# Altium project NUCLEOG431RB-Custom-IN-A2212.PrjPcb (part 2 of 4)

## Sheet Isolated_Bias.SchDoc
size B
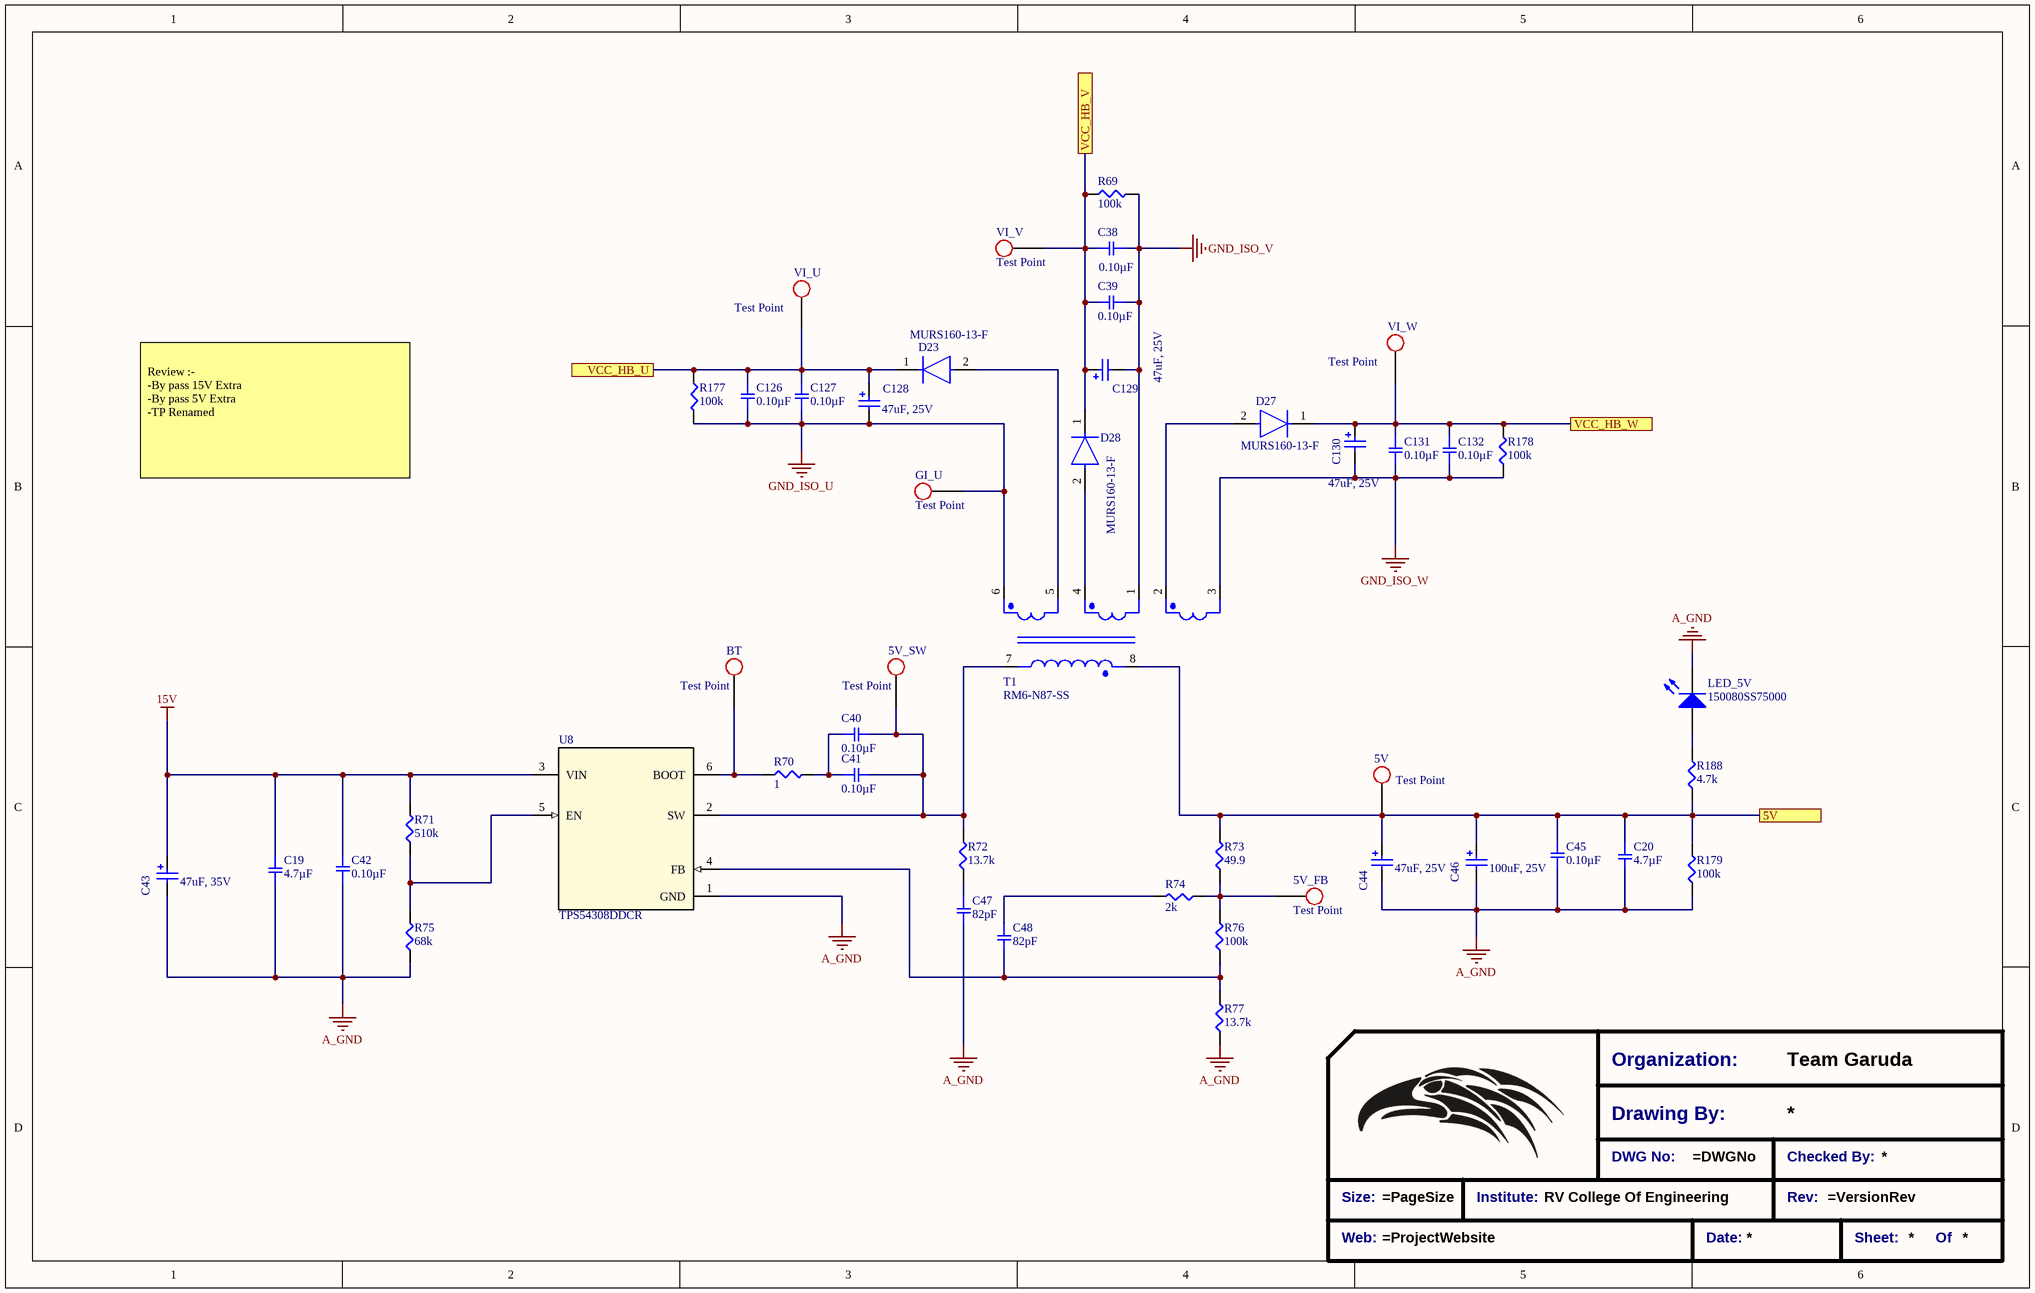
[diagram p2: Isolated_Bias.SchDoc]

### Parts
(Parts that share a designator on the sheet are numbered #1, #2 ... from top to bottom, then left to right.)
5V  Test Point  [Test_point_THT]  (no BOM)
5V_FB  Test Point  [Test_point_THT]  (no BOM)
5V_SW  Test Point  [Test_point_THT]  (no BOM)
*?#2  Title_Block  (value not drawn)  (graphical)
BT  Test Point  [Test_point_THT]  (no BOM)
C19  4.7µF  [SMD-1206C]
C20  4.7µF  [SMD-1206C]
C38  0.10µF  [SMD-0603C]
C39  0.10µF  [SMD-0805C]
C40  0.10µF  [SMD-0805C]
C41  0.10µF  [SMD-0805C]
C42  0.10µF  [SMD-0805C]
C43  47uF, 35V  [WCAP-ASLL_6.3x5.5]
C44  47uF, 25V  [WCAP-ASLL_6.3x5.5]
C45  0.10µF  [SMD-0603C]
C46  100uF, 25V  [WCAP-ASLU_8x6.5]
C47  82pF  [SMD-0805C]
C48  82pF  [SMD-0805C]
C126  0.10µF  [SMD-0805C]
C127  0.10µF  [SMD-0603C]
C128  47uF, 25V  [WCAP-ASLL_6.3x5.5]
C129  47uF, 25V  [WCAP-ASLL_6.3x5.5]
C130  47uF, 25V  [WCAP-ASLL_6.3x5.5]
C131  0.10µF  [SMD-0805C]
C132  0.10µF  [SMD-0603C]
D23  MURS160-13-F  [FP-SMB-MFG]
D27  MURS160-13-F  [FP-SMB-MFG]
D28  MURS160-13-F  [FP-SMB-MFG]
GI_U  Test Point  [Test_point_THT]  (no BOM)
LED_5V  150080SS75000  [0805_A]
R69  100k  [SMD-1206-RES]
R70  1  [SMD-0603-RES]
R71  510k  [SMD-0603-RES]
R72  13.7k  [SMD-0603-RES]
R73  49.9  [SMD-0603-RES]
R74  2k  [SMD-0603-RES]
R75  68k  [SMD-0603-RES]
R76  100k  [SMD-0603-RES]
R77  13.7k  [SMD-0603-RES]
R177  100k  [SMD-1206-RES]
R178  100k  [SMD-1206-RES]
R179  100k  [SMD-1206-RES]
R188  4.7k  [SMD-0805-RES]
T1  RM6-N87-SS  [RM6-N87-SS]
U8  TPS54308DDCR  [SOT95P278X110-6N]
VI_U  Test Point  [Test_point_THT]  (no BOM)
VI_V  Test Point  [Test_point_THT]  (no BOM)
VI_W  Test Point  [Test_point_THT]  (no BOM)

### Ports
5V, VCC_HB_U, VCC_HB_V, VCC_HB_W

### Nets
5V: 5V.1 C20.1 C44.2(P) C45.2 C46.2(P) R73.2 R179.2 R188.1 T1.8 ; port 5V
15V: C19.1 C42.2 C43.2(P) R71.2 U8.3(VIN)
A_GND: C19.2 C20.2 C42.1 C43.1(N) C44.1(N) C45.1 C46.1(N) C47.2 LED_5V.1(K) R75.1 R77.1 R179.1 U8.1(GND)
GND_ISO_U: C126.1 C127.1 C128.1(N) GI_U.1 R177.2 T1.6
GND_ISO_V: C38.1 C39.1 C129.1(N) R69.2 T1.1
GND_ISO_W: C130.1(N) C131.1 C132.1 R178.1 T1.3
VCC_HB_U: C126.2 C127.2 C128.2(P) D23.1(C) R177.1 VI_U.1 ; port VCC_HB_U
VCC_HB_V: C38.2 C39.2 C129.2(P) D28.1(C) R69.1 VI_V.1 ; port VCC_HB_V
VCC_HB_W: C130.2(P) C131.2 C132.2 D27.1(C) R178.2 VI_W.1 ; port VCC_HB_W
Net5V_FB_1: 5V_FB.1 R73.1 R74.1 R76.2
Net5V_SW_1: 5V_SW.1 C40.2 C41.2 R72.2 T1.7 U8.2(SW)
NetBT_1: BT.1 R70.1 U8.6(BOOT)
NetC40_1: C40.1 C41.1 R70.2
NetC47_1: C47.1 R72.1
NetC48_1: C48.1 R74.2
NetC48_2: C48.2 R76.1 R77.2 U8.4(FB)
NetD23_2: D23.2(A) T1.5
NetD27_2: D27.2(A) T1.2
NetD28_2: D28.2(A) T1.4
NetLED_5V_2: LED_5V.2(A) R188.2
NetR71_1: R71.1 R75.2 U8.5(EN)

### Notes on the sheet
- Review :-
  -By pass 15V Extra
  -By pass 5V Extra
  -TP Renamed
- (in symbol Title_Block) Organization:; Team Garuda; Drawing By:; DWG No:; Checked By:; Size:; Institute:; RV College Of Engineering; Rev:; Web:; Date:; Sheet:; Of

### Library data of the parts
*?#2 = Title_Block: Standard Title Block
C19 C20 = GCJ31CR71E475KA12L: CAP CER 4.7UF 25V X7R 1206; Manufacturer: Murata Electronics North America; Factory Stock: 0; Unit Price (USD): 0.65; Minimum Quantity: 1; Tolerance: ±10%; Datasheets: http://www.murata.com/~/media/webrenewal/support/library/catalog/products/capacitor/mlcc/c03e.ashx; Image: //media.digikey.com/Renders/Murata%20Renders/GR331BD72E473KW01L.jpg; Digi-Key Part Number: 490-5808-1-ND; Part Number: GCJ31CR71E475KA12L; Quantity Available: 31743; @ qty: 0; Packaging: Cut Tape (CT); Series: GCJ; Part Status: Active; Value: 4.7µF; Voltage: 25V; Temperature Coefficient: X7R; Operating Temperature: -55°C ~ 125°C; Features: Soft Termination; Ratings: AEC-Q200; Applications: Automotive, Boardflex Sensitive; Mounting Type: Surface Mount, MLCC; Package / Case: 1206 (3216 Metric); Size / Dimension: 0.126" L x 0.063" W (3.20mm x 1.60mm); Height - Seated (Max): -; Thickness (Max): 0.075" (1.90mm); Lead Spacing: -; Lead Style: -
C38 C45 C127 C132 = GCM188R71C104KA37D: CAP CER 0.1UF 16V X7R 0603; Manufacturer: Murata Electronics North America; Factory Stock: 0; Unit Price (USD): 0.18; Minimum Quantity: 1; Tolerance: ±10%; Datasheets: http://www.murata.com/~/media/webrenewal/support/library/catalog/products/capacitor/mlcc/c03e.ashx; Image: //media.digikey.com/Renders/Murata%20Renders/0603%28GCM188%29.jpg; Digi-Key Part Number: 490-4774-1-ND; Part Number: GCM188R71C104KA37D; Quantity Available: 284085; @ qty: 0; Packaging: Cut Tape (CT); Series: GCM; Part Status: Active; Value: 0.10µF; Voltage: 16V; Temperature Coefficient: X7R; Operating Temperature: -55°C ~ 125°C; Features: -; Ratings: AEC-Q200; Applications: Automotive; Mounting Type: Surface Mount, MLCC; Package / Case: 0603 (1608 Metric); Size / Dimension: 0.063" L x 0.031" W (1.60mm x 0.80mm); Height - Seated (Max): -; Thickness (Max): 0.035" (0.90mm); Lead Spacing: -; Lead Style: -
C39-C42 C126 C131 = GCD21BR71H104KA01L: CAP CER 0.1UF 50V X7R 0805; Manufacturer: Murata Electronics North America; Factory Stock: 0; Unit Price (USD): 0.24; Minimum Quantity: 1; Tolerance: ±10%; Datasheets: http://www.murata.com/~/media/webrenewal/support/library/catalog/products/capacitor/mlcc/c03e.ashx; Image: //media.digikey.com/Renders/Murata%20Renders/0805%28GxM6%29.jpg; Digi-Key Part Number: 490-11955-1-ND; Part Number: GCD21BR71H104KA01L; Quantity Available: 157; @ qty: 0; Packaging: Cut Tape (CT); Series: GCD; Part Status: Active; Value: 0.10µF; Voltage: 50V; Temperature Coefficient: X7R; Operating Temperature: -55°C ~ 125°C; Features: -; Ratings: AEC-Q200; Applications: Automotive; Mounting Type: Surface Mount, MLCC; Package / Case: 0805 (2012 Metric); Size / Dimension: 0.079" L x 0.049" W (2.00mm x 1.25mm); Height - Seated (Max): -; Thickness (Max): 0.049" (1.25mm); Lead Spacing: -; Lead Style: -
C43 = 865060543005: WCAP-ASLL SMT Aluminum Electrolytic Capacitors, D6.3mm x L5.5mm, 47uF, +/-20%, 35VDC; Dissipation Factor: 14%; Endurance: 2000h; Leakage Current: 16.45uA; Ripple Current max.: 240mA; Technical Reference: ASED055470M035DVCTBB000; ComponentLink1Description: Manufacturer; ComponentLink1URL: http://www.we-online.de; ComponentLink2Description: Datasheet; ComponentLink2URL: https://katalog.we-online.com/pbs/datasheet/865060543005.pdf; Length: 5.5mm; Mounting Technology: SMT; Operating Temperature: -55 to +105degC; Packaging: Tape and Reel; Published Date: August 2019; Capacitance: 47uF; Diameter: 6.3mm; Part Number: 865060543005; Publisher: Wurth Elektronik; Capacitance Tolerance: +/-20%; Rated Voltage: 35VDC
C44 C128-C130 = 865060443004: WCAP-ASLL SMT Aluminum Electrolytic Capacitors, D6.3mm x L5.5mm, 47uF, +/-20%, 25VDC; Dissipation Factor: 14%; Endurance: 2000h; Leakage Current: 11.75uA; Ripple Current max.: 230mA; Technical Reference: ASED055470M025DVCTBB000; ComponentLink1Description: Manufacturer; ComponentLink1URL: http://www.we-online.de; ComponentLink2Description: Datasheet; ComponentLink2URL: https://katalog.we-online.com/pbs/datasheet/865060443004.pdf; Length: 5.5mm; Mounting Technology: SMT; Operating Temperature: -55 to +105degC; Packaging: Tape and Reel; Published Date: August 2019; Capacitance: 47uF; Diameter: 6.3mm; Part Number: 865060443004; Publisher: Wurth Elektronik; Capacitance Tolerance: +/-20%; Rated Voltage: 25VDC
C46 = 865090449009: WCAP-ASLU Aluminium Electrolytic Capacitors, D8mm x L6.5mm, 100uF, +/-20%, 25VDC; Dissipation Factor: 16%; Leakage Current: 5uA; Endurance: 1000h; Technical Reference: ASBE065101M025DVCTBA000; Ripple Current max.: 110mA; ComponentLink1Description: Manufacturer; ComponentLink1URL: http://www.we-online.de; ComponentLink2Description: Datasheet; ComponentLink2URL: https://katalog.we-online.com/pbs/datasheet/865090449009.pdf; Mounting Technology: SMD; Operating Temperature: -40 to +85degC; Packaging: Tape and Reel; Part Number: 865090449009; Publisher: Wurth Elektronik; Capacitance: 100uF; Diameter: 8mm; Length: 6.5mm; Published Date: August 2019; Rated Voltage: 25VDC; Capacitance Tolerance: +/-20%
C47 C48 = GQM2195C1H820JB01D: CAP CER 82PF 50V NP0 0805; Manufacturer: Murata Electronics North America; Factory Stock: 0; Unit Price (USD): 1.22; Minimum Quantity: 1; Tolerance: ±5%; Temperature Coefficient: C0G, NP0; Datasheets: http://www.murata.com/~/media/webrenewal/support/library/catalog/products/capacitor/mlcc/c02e.pdf; Image: //media.digikey.com/Renders/Murata%20Renders/0805(GxM9).jpg; Digi-Key Part Number: 490-3615-1-ND; Part Number: GQM2195C1H820JB01D; Quantity Available: 7488; @ qty: 0; Packaging: Cut Tape (CT); Series: GQM; Part Status: Active; Value: 82pF; Voltage: 50V; Operating Temperature: -55°C ~ 125°C; Features: High Q, Low Loss; Ratings: -; Applications: RF, Microwave, High Frequency; Mounting Type: Surface Mount, MLCC; Package / Case: 0805 (2012 Metric); Size / Dimension: 0.079" L x 0.049" W (2.00mm x 1.25mm); Height - Seated (Max): -; Thickness (Max): 0.037" (0.95mm); Lead Spacing: -; Lead Style: -
D23 D27 D28 = CMP-12791-000032-1: DIODE GEN PURP 600V 1A SMB; Manufacturer: Diodes Inc.; Standoff Height: 0.05mm; Max Surge Forward Current: 35A; Capacitance: 10pF; Peak Reverse Current: 5uA; Max Junction Temp: +150°C; Value: 10pF; Reverse Voltage: 600V; Device Class L1: Discrete Semiconductors; Lead Free: Yes; Temperature Range Low: -55°C; Mouser Description: Rectifier Super-Fast Recovery Gpp Smb 1.0A 600V Rohs 3K Rohs Compliant: Yes; Temperature: -55°C to +150°C; Category: Diode; Digikey Description: DIODE GEN PURP 600V 1A SMB; Height: 2.5mm; Manufacturer Part Number: MURS160-13-F; RoHS: TRUE; ComponentLink2Description: Datasheet; Octopart: https://octopart.com/murs160-13-f-diodes+inc.-332437; ComponentLink2URL: https://www.diodes.com/assets/Datasheets/ds30130.pdf; Automotive: No; Max Repetitive Reverse Voltage: 600V; Footprint Url: https://www.diodes.com/assets/Package-Files/SMB.pdf; Device Class L3: Rectifier Diodes; Temperature Range High: +150°C; Device Class L2: Diodes; Package: SMB; Forward Current: 1A
LED_5V = 150080SS75000: SMD mono-color Chip LED, WL-SMCW, Super Red; PackageReference: 0805_A; Color: Super Red; PartNumber: 150080SS75000; ComponentLink1Description: Manufacturer URL; ComponentLink1URL: http://www.we-online.com; ComponentLink2Description: Datasheet; ComponentLink2URL: http://katalog.we-online.com/led/datasheet/150080SS75000.pdf
R69 R177-R179 = ERJ-8ENF1003V: RES SMD 100K OHM 1% 1/4W 1206; Manufacturer: Panasonic Electronic Components; Factory Stock: 0; Unit Price (USD): 0.00933; @ qty: 1500; Minimum Quantity: 1; Power (Watts): 0.25W, 1/4W; Temperature Coefficient: ±100ppm/°C; Part Number: ERJ-8ENF1003V; Datasheets: http://industrial.panasonic.com/www-cgi/jvcr13pz.cgi?E+PZ+3+AOA0002+ERJ8ENF1003V+7+WW; Image: //media.digikey.com/Renders/Panasonic%20Renders/ERJ-1206%20Pkg.jpg; Digi-Key Part Number: P100KFCT-ND; Quantity Available: 576605; Packaging: Cut Tape (CT); Series: ERJ; Part Status: Active; Value: 100k; Tolerance: ±1%; Composition: Thick Film; Features: Automotive AEC-Q200; Operating Temperature: -55°C ~ 155°C; Package / Case: 1206 (3216 Metric); Supplier Device Package: 1206; Size / Dimension: 0.126" L x 0.063" W (3.20mm x 1.60mm); Height - Seated (Max): 0.028" (0.70mm); Number of Terminations: 2; Failure Rate: -
R70 = ERJ-3BQF1R0V: RES SMD 1 OHM 1% 1/4W 0603; Manufacturer: Panasonic Electronic Components; Factory Stock: 0; Unit Price (USD): 0.05386; @ qty: 1500; Power (Watts): 0.25W, 1/4W; Temperature Coefficient: ±200ppm/°C; Part Number: ERJ-3BQF1R0V; Datasheets: https://industrial.panasonic.com/cdbs/www-data/pdf/RDA0000/AOA0000C239.pdf; Image: //media.digikey.com/Photos/Panasonic%20Photos/MFG_ERJ-P6W%20Series.jpg; Digi-Key Part Number: P17371CT-ND; Quantity Available: 30514; Minimum Quantity: 1; Packaging: Cut Tape (CT); Series: ERJ; Part Status: Active; Value: 1; Tolerance: ±1%; Composition: Thick Film; Features: Automotive AEC-Q200, Current Sense; Operating Temperature: -55°C ~ 125°C; Package / Case: 0603 (1608 Metric); Supplier Device Package: 0603; Size / Dimension: 0.063" L x 0.031" W (1.60mm x 0.80mm); Height - Seated (Max): 0.022" (0.55mm); Number of Terminations: 2; Failure Rate: -
R71 = ERJ-3EKF5103V: RES SMD 510K OHM 1% 1/10W 0603; Manufacturer: Panasonic Electronic Components; Factory Stock: 0; Unit Price (USD): 0.00379; @ qty: 1500; Minimum Quantity: 1; Power (Watts): 0.1W, 1/10W; Temperature Coefficient: ±100ppm/°C; Part Number: ERJ-3EKF5103V; Datasheets: http://industrial.panasonic.com/www-cgi/jvcr13pz.cgi?E+PZ+3+AOA0002+ERJ3EKF5103V+7+WW; Image: //media.digikey.com/Photos/Panasonic%20Photos/MFG_ERJ-P6W%20Series.jpg; Digi-Key Part Number: P510KHCT-ND; Quantity Available: 132059; Packaging: Cut Tape (CT); Series: ERJ; Part Status: Active; Value: 510k; Tolerance: ±1%; Composition: Thick Film; Features: Automotive AEC-Q200; Operating Temperature: -55°C ~ 155°C; Package / Case: 0603 (1608 Metric); Supplier Device Package: 0603; Size / Dimension: 0.063" L x 0.031" W (1.60mm x 0.80mm); Height - Seated (Max): 0.022" (0.55mm); Number of Terminations: 2; Failure Rate: -
R72 R77 = ERJ-3EKF1372V: RES SMD 13.7K OHM 1% 1/10W 0603; Manufacturer: Panasonic Electronic Components; Factory Stock: 0; Unit Price (USD): 0.00379; @ qty: 1500; Minimum Quantity: 1; Power (Watts): 0.1W, 1/10W; Temperature Coefficient: ±100ppm/°C; Part Number: ERJ-3EKF1372V; Datasheets: http://industrial.panasonic.com/www-cgi/jvcr13pz.cgi?E+PZ+3+AOA0002+ERJ3EKF1372V+7+WW; Image: //media.digikey.com/Photos/Panasonic%20Photos/MFG_ERJ-P6W%20Series.jpg; Digi-Key Part Number: P13.7KHCT-ND; Quantity Available: 81314; Packaging: Cut Tape (CT); Series: ERJ; Part Status: Active; Value: 13.7k; Tolerance: ±1%; Composition: Thick Film; Features: Automotive AEC-Q200; Operating Temperature: -55°C ~ 155°C; Package / Case: 0603 (1608 Metric); Supplier Device Package: 0603; Size / Dimension: 0.063" L x 0.031" W (1.60mm x 0.80mm); Height - Seated (Max): 0.022" (0.55mm); Number of Terminations: 2; Failure Rate: -
R73 = ERJ-3EKF49R9V: RES SMD 49.9 OHM 1% 1/10W 0603; Manufacturer: Panasonic Electronic Components; Factory Stock: 0; Unit Price (USD): 0.00379; @ qty: 1500; Minimum Quantity: 1; Power (Watts): 0.1W, 1/10W; Temperature Coefficient: ±100ppm/°C; Part Number: ERJ-3EKF49R9V; Datasheets: http://industrial.panasonic.com/www-cgi/jvcr13pz.cgi?E+PZ+3+AOA0002+ERJ3EKF49R9V+7+WW; Image: //media.digikey.com/Photos/Panasonic%20Photos/MFG_ERJ-P6W%20Series.jpg; Digi-Key Part Number: P49.9HCT-ND; Quantity Available: 566023; Packaging: Cut Tape (CT); Series: ERJ; Part Status: Active; Value: 49.9; Tolerance: ±1%; Composition: Thick Film; Features: Automotive AEC-Q200; Operating Temperature: -55°C ~ 155°C; Package / Case: 0603 (1608 Metric); Supplier Device Package: 0603; Size / Dimension: 0.063" L x 0.031" W (1.60mm x 0.80mm); Height - Seated (Max): 0.022" (0.55mm); Number of Terminations: 2; Failure Rate: -
R74 = ERJ-3EKF2001V: RES SMD 2K OHM 1% 1/10W 0603; Manufacturer: Panasonic Electronic Components; Factory Stock: 0; Unit Price (USD): 0.00379; @ qty: 1500; Minimum Quantity: 1; Power (Watts): 0.1W, 1/10W; Temperature Coefficient: ±100ppm/°C; Part Number: ERJ-3EKF2001V; Datasheets: http://industrial.panasonic.com/www-cgi/jvcr13pz.cgi?E+PZ+3+AOA0002+ERJ3EKF2001V+7+WW; Image: //media.digikey.com/Photos/Panasonic%20Photos/MFG_ERJ-P6W%20Series.jpg; Digi-Key Part Number: P2.00KHCT-ND; Quantity Available: 1021544; Packaging: Cut Tape (CT); Series: ERJ; Part Status: Active; Value: 2k; Tolerance: ±1%; Composition: Thick Film; Features: Automotive AEC-Q200; Operating Temperature: -55°C ~ 155°C; Package / Case: 0603 (1608 Metric); Supplier Device Package: 0603; Size / Dimension: 0.063" L x 0.031" W (1.60mm x 0.80mm); Height - Seated (Max): 0.022" (0.55mm); Number of Terminations: 2; Failure Rate: -
R75 = ERJ-3EKF6802V: RES SMD 68K OHM 1% 1/10W 0603; Manufacturer: Panasonic Electronic Components; Factory Stock: 0; Unit Price (USD): 0.00379; @ qty: 1500; Minimum Quantity: 1; Power (Watts): 0.1W, 1/10W; Temperature Coefficient: ±100ppm/°C; Part Number: ERJ-3EKF6802V; Datasheets: http://industrial.panasonic.com/www-cgi/jvcr13pz.cgi?E+PZ+3+AOA0002+ERJ3EKF6802V+7+WW; Image: //media.digikey.com/Photos/Panasonic%20Photos/MFG_ERJ-P6W%20Series.jpg; Digi-Key Part Number: P68.0KHCT-ND; Quantity Available: 63788; Packaging: Cut Tape (CT); Series: ERJ; Part Status: Active; Value: 68k; Tolerance: ±1%; Composition: Thick Film; Features: Automotive AEC-Q200; Operating Temperature: -55°C ~ 155°C; Package / Case: 0603 (1608 Metric); Supplier Device Package: 0603; Size / Dimension: 0.063" L x 0.031" W (1.60mm x 0.80mm); Height - Seated (Max): 0.022" (0.55mm); Number of Terminations: 2; Failure Rate: -
R76 = ERJ-3GEYJ104V: RES SMD 100K OHM 5% 1/10W 0603; Manufacturer: Panasonic Electronic Components; Factory Stock: 0; Unit Price (USD): 0.00321; @ qty: 1500; Minimum Quantity: 1; Power (Watts): 0.1W, 1/10W; Temperature Coefficient: ±200ppm/°C; Part Number: ERJ-3GEYJ104V; Datasheets: http://industrial.panasonic.com/www-cgi/jvcr13pz.cgi?E+PZ+3+AOA0001+ERJ3GEYJ104V+7+WW; Image: //media.digikey.com/Photos/Panasonic%20Photos/MFG_ERJ-P6W%20Series.jpg; Digi-Key Part Number: P100KGCT-ND; Quantity Available: 1377078; Packaging: Cut Tape (CT); Series: ERJ; Part Status: Active; Value: 100k; Tolerance: ±5%; Composition: Thick Film; Features: Automotive AEC-Q200; Operating Temperature: -55°C ~ 155°C; Package / Case: 0603 (1608 Metric); Supplier Device Package: 0603; Size / Dimension: 0.063" L x 0.031" W (1.60mm x 0.80mm); Height - Seated (Max): 0.022" (0.55mm); Number of Terminations: 2; Failure Rate: -
R188 = ERJ-6ENF4701V: RES SMD 4.7K OHM 1% 1/8W 0805; Manufacturer: Panasonic Electronic Components; Factory Stock: 0; Unit Price (USD): 0.00729; @ qty: 1500; Minimum Quantity: 1; Power (Watts): 0.125W, 1/8W; Temperature Coefficient: ±100ppm/°C; Part Number: ERJ-6ENF4701V; Datasheets: http://industrial.panasonic.com/www-cgi/jvcr13pz.cgi?E+PZ+3+AOA0002+ERJ6ENF4701V+7+WW; Image: //media.digikey.com/Renders/Panasonic%20Renders/ERJ-0805%20Pkg.jpg; Digi-Key Part Number: P4.70KCCT-ND; Quantity Available: 312387; Packaging: Cut Tape (CT); Series: ERJ; Part Status: Active; Value: 4.7k; Tolerance: ±1%; Composition: Thick Film; Features: Automotive AEC-Q200; Operating Temperature: -55°C ~ 155°C; Package / Case: 0805 (2012 Metric); Supplier Device Package: 0805; Size / Dimension: 0.079" L x 0.049" W (2.00mm x 1.25mm); Height - Seated (Max): 0.028" (0.70mm); Number of Terminations: 2; Failure Rate: -
U8 = TPS54308DDCR: Imported; Manufacturer: Texas Instruments; PartNumber: TPS54308DDCR; RefDes: RefDes; Type: DEV; Value: Value; Manufacturer_Part_Number: TPS54308DDCR; Manufacturer_Name: Texas Instruments

## Sheet Power_Section.SchDoc
size C
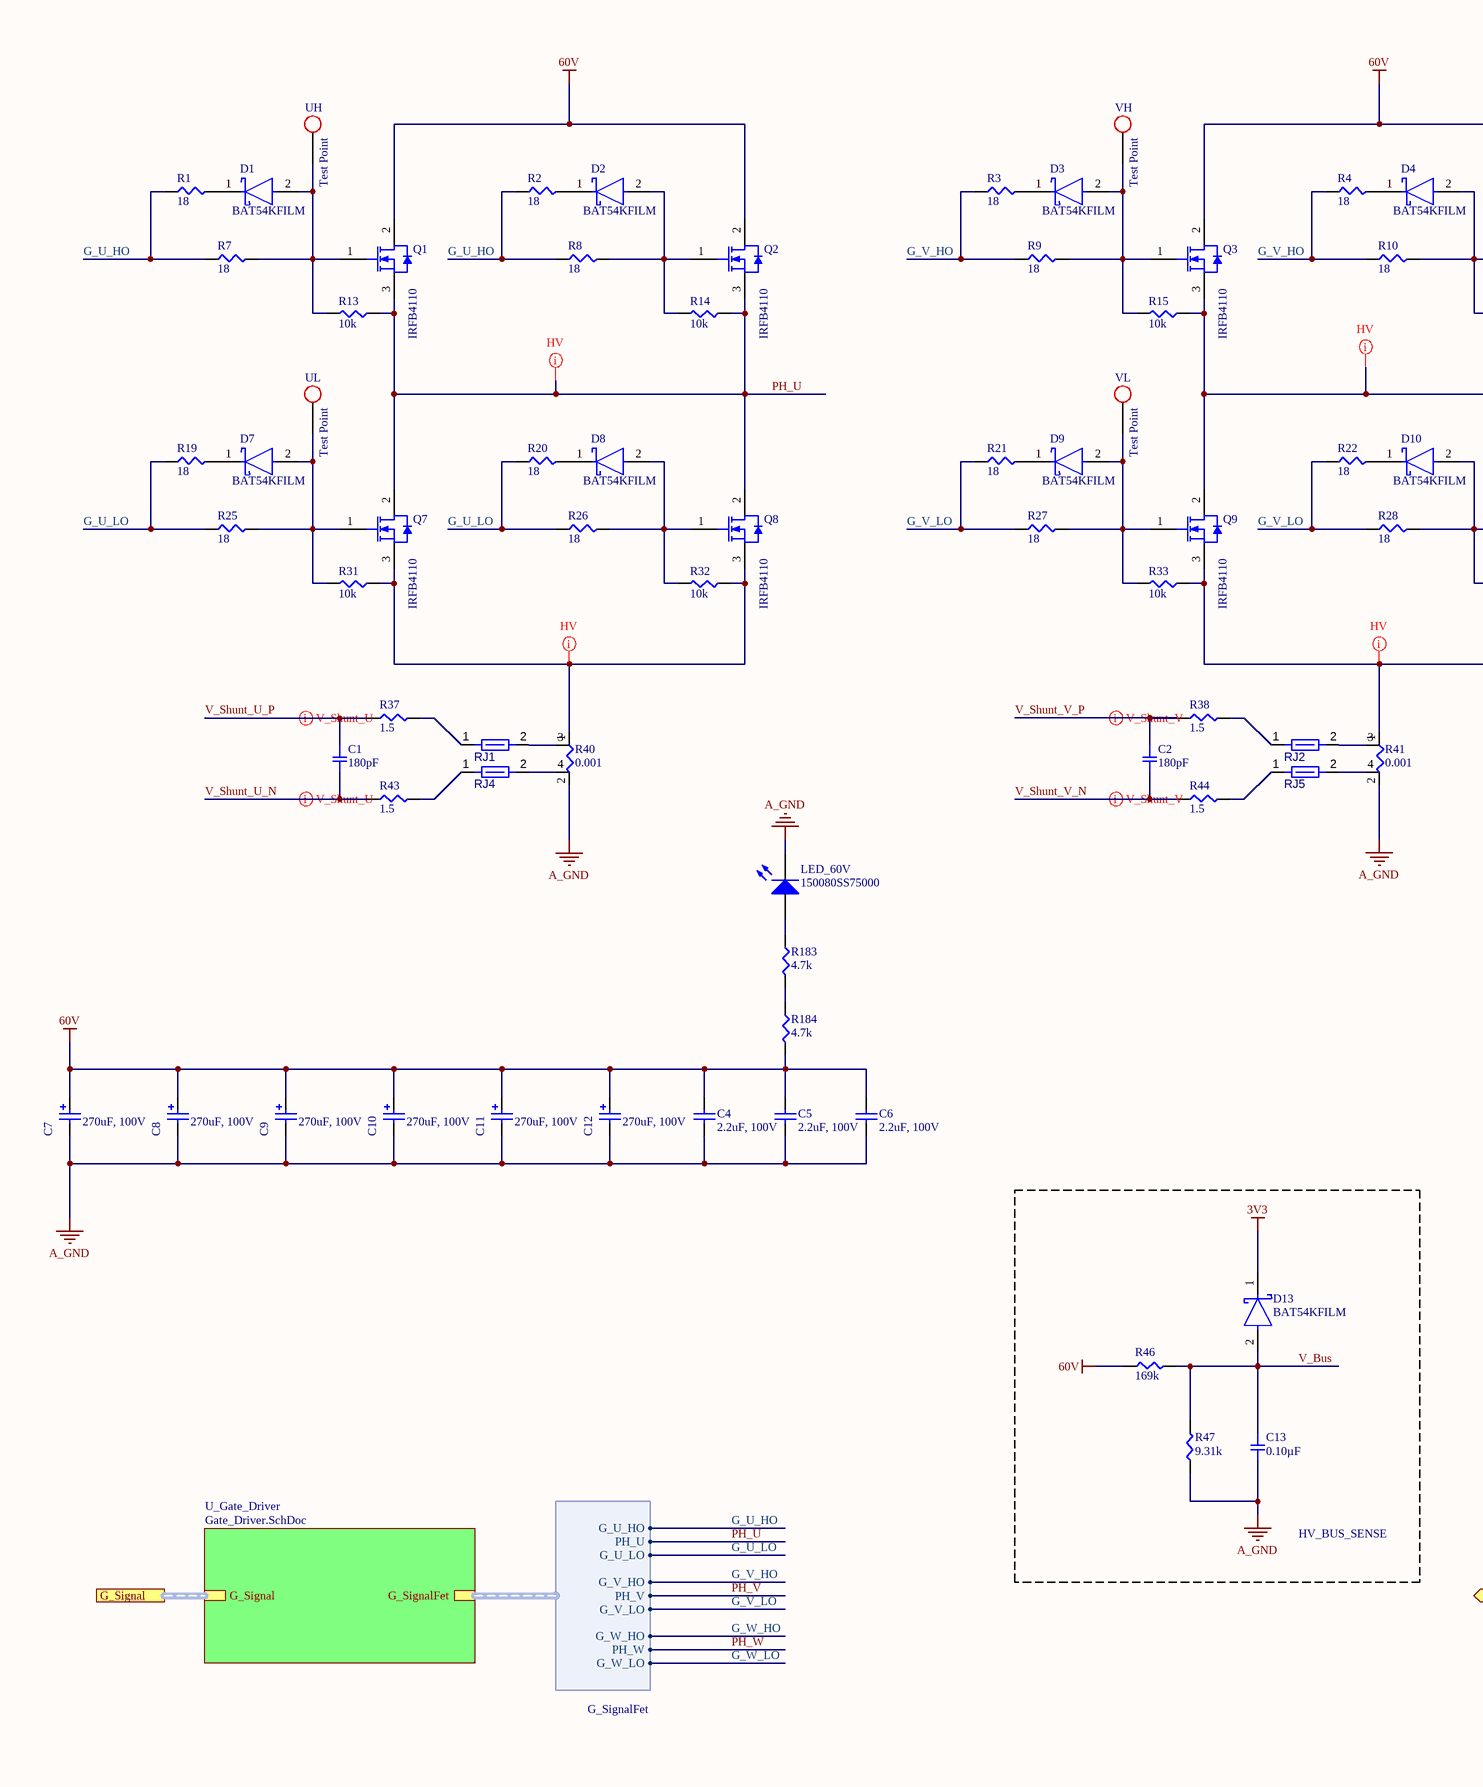
[diagram p3: Power_Section.SchDoc, left]
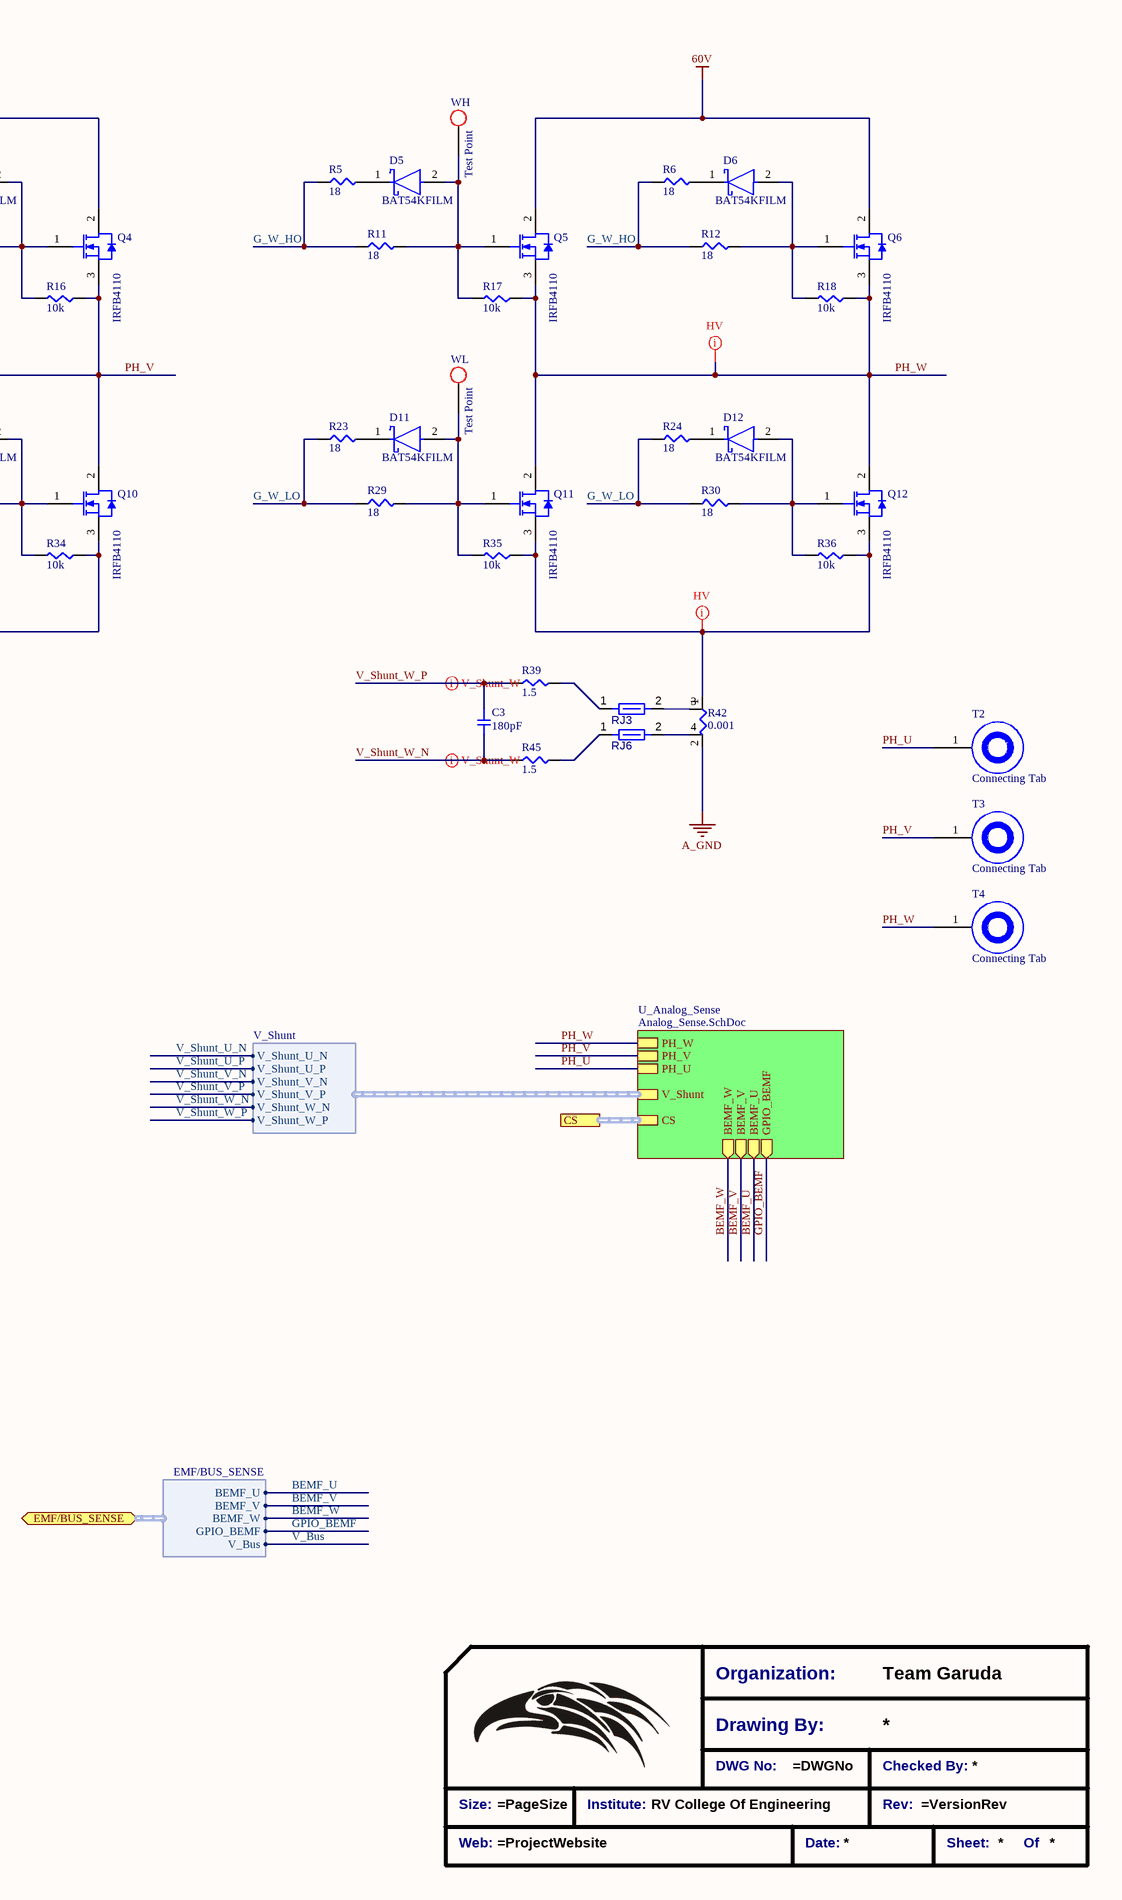
[diagram p4: Power_Section.SchDoc, right]

### Parts
(Parts that share a designator on the sheet are numbered #1, #2 ... from top to bottom, then left to right.)
*?#3  Title_Block  (value not drawn)  (graphical)
C1  180pF  [SMD-0805C]
C2  180pF  [SMD-0805C]
C3  180pF  [SMD-0805C]
C4  2.2uF, 100V  [L18_W8.5_H15_P15]
C5  2.2uF, 100V  [L18_W8.5_H15_P15]
C6  2.2uF, 100V  [L18_W8.5_H15_P15]
C7  270uF, 100V  [WCAP-ATUL_16x25]
C8  270uF, 100V  [WCAP-ATUL_16x25]
C9  270uF, 100V  [WCAP-ATUL_16x25]
C10  270uF, 100V  [WCAP-ATUL_16x25]
C11  270uF, 100V  [WCAP-ATUL_16x25]
C12  270uF, 100V  [WCAP-ATUL_16x25]
C13  0.10µF  [SMD-0805C]
D1  BAT54KFILM  [FP-SOD-523-MFG]
D2  BAT54KFILM  [FP-SOD-523-MFG]
D3  BAT54KFILM  [FP-SOD-523-MFG]
D4  BAT54KFILM  [FP-SOD-523-MFG]
D5  BAT54KFILM  [FP-SOD-523-MFG]
D6  BAT54KFILM  [FP-SOD-523-MFG]
D7  BAT54KFILM  [FP-SOD-523-MFG]
D8  BAT54KFILM  [FP-SOD-523-MFG]
D9  BAT54KFILM  [FP-SOD-523-MFG]
D10  BAT54KFILM  [FP-SOD-523-MFG]
D11  BAT54KFILM  [FP-SOD-523-MFG]
D12  BAT54KFILM  [FP-SOD-523-MFG]
D13  BAT54KFILM  [FP-SOD-523-MFG]
LED_60V  150080SS75000  [0805_A]
Q1  IRFB4110  [TO-220-3_Horizontal_TabUp]
Q2  IRFB4110  [TO-220-3_Horizontal_TabUp]
Q3  IRFB4110  [TO-220-3_Horizontal_TabUp]
Q4  IRFB4110  [TO-220-3_Horizontal_TabUp]
Q5  IRFB4110  [TO-220-3_Horizontal_TabUp]
Q6  IRFB4110  [TO-220-3_Horizontal_TabUp]
Q7  IRFB4110  [TO-220-3_Horizontal_TabUp]
Q8  IRFB4110  [TO-220-3_Horizontal_TabUp]
Q9  IRFB4110  [TO-220-3_Horizontal_TabUp]
Q10  IRFB4110  [TO-220-3_Horizontal_TabUp]
Q11  IRFB4110  [TO-220-3_Horizontal_TabUp]
Q12  IRFB4110  [TO-220-3_Horizontal_TabUp]
R1  18  [SMD-0805-RES]
R2  18  [SMD-0805-RES]
R3  18  [SMD-0805-RES]
R4  18  [SMD-0805-RES]
R5  18  [SMD-0805-RES]
R6  18  [SMD-0805-RES]
R7  18  [SMD-0805-RES]
R8  18  [SMD-0805-RES]
R9  18  [SMD-0805-RES]
R10  18  [SMD-0805-RES]
R11  18  [SMD-0805-RES]
R12  18  [SMD-0805-RES]
R13  10k  [SMD-0805-RES]
R14  10k  [SMD-0805-RES]
R15  10k  [SMD-0805-RES]
R16  10k  [SMD-0805-RES]
R17  10k  [SMD-0805-RES]
R18  10k  [SMD-0805-RES]
R19  18  [SMD-0805-RES]
R20  18  [SMD-0805-RES]
R21  18  [SMD-0805-RES]
R22  18  [SMD-0805-RES]
R23  18  [SMD-0805-RES]
R24  18  [SMD-0805-RES]
R25  18  [SMD-0805-RES]
R26  18  [SMD-0805-RES]
R27  18  [SMD-0805-RES]
R28  18  [SMD-0805-RES]
R29  18  [SMD-0805-RES]
R30  18  [SMD-0805-RES]
R31  10k  [SMD-0805-RES]
R32  10k  [SMD-0805-RES]
R33  10k  [SMD-0805-RES]
R34  10k  [SMD-0805-RES]
R35  10k  [SMD-0805-RES]
R36  10k  [SMD-0805-RES]
R37  1.5  [SMD-0805-RES]
R38  1.5  [SMD-0805-RES]
R39  1.5  [SMD-0805-RES]
R40  0.001  [SMD-2512-RES]  (net tie)
R41  0.001  [SMD-2512-RES]  (net tie)
R42  0.001  [SMD-2512-RES]  (net tie)
R43  1.5  [SMD-0805-RES]
R44  1.5  [SMD-0805-RES]
R45  1.5  [SMD-0805-RES]
R46  169k  [SMD-0805-RES]
R47  9.31k  [SMD-0805-RES]
R183  4.7k  [SMD-1206-RES]
R184  4.7k  [SMD-1206-RES]
RJ1  Net Tie 12x8mil  [SHORT06-FP]  (value not drawn)  (net tie, no BOM)
RJ2  Net Tie 12x8mil  [SHORT06-FP]  (value not drawn)  (net tie, no BOM)
RJ3  Net Tie 12x8mil  [SHORT06-FP]  (value not drawn)  (net tie, no BOM)
RJ4  Net Tie 12x8mil  [SHORT06-FP]  (value not drawn)  (net tie, no BOM)
RJ5  Net Tie 12x8mil  [SHORT06-FP]  (value not drawn)  (net tie, no BOM)
RJ6  Net Tie 12x8mil  [SHORT06-FP]  (value not drawn)  (net tie, no BOM)
T2  Connecting Tab  [Tab]
T3  Connecting Tab  [Tab]
T4  Connecting Tab  [Tab]
UH  Test Point  [Test_point_THT]  (no BOM)
UL  Test Point  [Test_point_THT]  (no BOM)
VH  Test Point  [Test_point_THT]  (no BOM)
VL  Test Point  [Test_point_THT]  (no BOM)
WH  Test Point  [Test_point_THT]  (no BOM)
WL  Test Point  [Test_point_THT]  (no BOM)

### Blocks framed on the sheet
HV_BUS_SENSE: C13 D13 R46 R47

### Sub-sheets
U_Analog_Sense = Analog_Sense.SchDoc: PH_W, PH_U, PH_V, CS (harness CS), BEMF_W (out), BEMF_V (out), BEMF_U (out), GPIO_BEMF (out), V_Shunt (harness V_Shunt)
U_Gate_Driver = Gate_Driver.SchDoc: G_Signal (harness G_Signal), G_SignalFet (harness G_SignalFet)

### Ports
CS (harness CS), EMF/BUS_SENSE (bidir, harness EMF/BUS_SENSE), G_Signal (harness G_Signal)

### Harnesses
G_SignalFet: G_V_HO, PH_V, G_V_LO, PH_W, G_U_HO, PH_U, G_U_LO, G_W_HO, G_W_LO
EMF/BUS_SENSE: BEMF_U, BEMF_V, BEMF_W, GPIO_BEMF, V_Bus
V_Shunt: V_Shunt_U_N, V_Shunt_U_P, V_Shunt_V_N, V_Shunt_V_P, V_Shunt_W_N, V_Shunt_W_P

### Nets
3v3: D13.1(C)
60V: C4.2 C5.2 C6.2 C7.2(P) C8.2(P) C9.2(P) C10.2(P) C11.2(P) C12.2(P) Q1.2(DRAIN) Q2.2(DRAIN) Q3.2(DRAIN) Q4.2(DRAIN) Q5.2(DRAIN) Q6.2(DRAIN) R46.1 R184.2
A_GND: C4.1 C5.1 C6.1 C7.1(N) C8.1(N) C9.1(N) C10.1(N) C11.1(N) C12.1(N) C13.2 LED_60V.1(K) R40.2 R41.2 R42.2 R47.1
BEMF_U: sheet U_Analog_Sense/BEMF_U, port EMF/BUS_SENSE.BEMF_U
BEMF_V: sheet U_Analog_Sense/BEMF_V, port EMF/BUS_SENSE.BEMF_V
BEMF_W: sheet U_Analog_Sense/BEMF_W, port EMF/BUS_SENSE.BEMF_W
G_U_HO: R1.1 R2.1 R7.1 R8.1 ; sheet U_Gate_Driver/G_SignalFet.G_U_HO
G_U_LO: R19.1 R20.1 R25.1 R26.1 ; sheet U_Gate_Driver/G_SignalFet.G_U_LO
G_V_HO: R3.1 R4.1 R9.1 R10.1 ; sheet U_Gate_Driver/G_SignalFet.G_V_HO
G_V_LO: R21.1 R22.1 R27.1 R28.1 ; sheet U_Gate_Driver/G_SignalFet.G_V_LO
G_W_HO: R5.1 R6.1 R11.1 R12.1 ; sheet U_Gate_Driver/G_SignalFet.G_W_HO
G_W_LO: R23.1 R24.1 R29.1 R30.1 ; sheet U_Gate_Driver/G_SignalFet.G_W_LO
GPIO_BEMF: sheet U_Analog_Sense/GPIO_BEMF, port EMF/BUS_SENSE.GPIO_BEMF
PH_U: Q1.3(SOURCE) Q2.3(SOURCE) Q7.2(DRAIN) Q8.2(DRAIN) R13.1 R14.1 T2.1 ; sheet U_Analog_Sense/PH_U, sheet U_Gate_Driver/G_SignalFet.PH_U
PH_V: Q3.3(SOURCE) Q4.3(SOURCE) Q9.2(DRAIN) Q10.2(DRAIN) R15.1 R16.1 T3.1 ; sheet U_Analog_Sense/PH_V, sheet U_Gate_Driver/G_SignalFet.PH_V
PH_W: Q5.3(SOURCE) Q6.3(SOURCE) Q11.2(DRAIN) Q12.2(DRAIN) R17.1 R18.1 T4.1 ; sheet U_Analog_Sense/PH_W, sheet U_Gate_Driver/G_SignalFet.PH_W
V_Bus: C13.1 D13.2(A) R46.2 R47.2 ; port EMF/BUS_SENSE.V_Bus
V_Shunt_U_N: C1.2 R43.1 ; sheet U_Analog_Sense/V_Shunt.V_Shunt_U_N
V_Shunt_U_P: C1.1 R37.1 ; sheet U_Analog_Sense/V_Shunt.V_Shunt_U_P
V_Shunt_V_N: C2.2 R44.1 ; sheet U_Analog_Sense/V_Shunt.V_Shunt_V_N
V_Shunt_V_P: C2.1 R38.1 ; sheet U_Analog_Sense/V_Shunt.V_Shunt_V_P
V_Shunt_W_N: C3.2 R45.1 ; sheet U_Analog_Sense/V_Shunt.V_Shunt_W_N
V_Shunt_W_P: C3.1 R39.1 ; sheet U_Analog_Sense/V_Shunt.V_Shunt_W_P
NetD1_1: D1.1(C) R1.2
NetD1_2: D1.2(A) Q1.1(GATE) R7.2 R13.2 UH.1
NetD2_1: D2.1(C) R2.2
NetD2_2: D2.2(A) Q2.1(GATE) R8.2 R14.2
NetD3_1: D3.1(C) R3.2
NetD3_2: D3.2(A) Q3.1(GATE) R9.2 R15.2 VH.1
NetD4_1: D4.1(C) R4.2
NetD4_2: D4.2(A) Q4.1(GATE) R10.2 R16.2
NetD5_1: D5.1(C) R5.2
NetD5_2: D5.2(A) Q5.1(GATE) R11.2 R17.2 WH.1
NetD6_1: D6.1(C) R6.2
NetD6_2: D6.2(A) Q6.1(GATE) R12.2 R18.2
NetD7_1: D7.1(C) R19.2
NetD7_2: D7.2(A) Q7.1(GATE) R25.2 R31.2 UL.1
NetD8_1: D8.1(C) R20.2
NetD8_2: D8.2(A) Q8.1(GATE) R26.2 R32.2
NetD9_1: D9.1(C) R21.2
NetD9_2: D9.2(A) Q9.1(GATE) R27.2 R33.2 VL.1
NetD10_1: D10.1(C) R22.2
NetD10_2: D10.2(A) Q10.1(GATE) R28.2 R34.2
NetD11_1: D11.1(C) R23.2
NetD11_2: D11.2(A) Q11.1(GATE) R29.2 R35.2 WL.1
NetD12_1: D12.1(C) R24.2
NetD12_2: D12.2(A) Q12.1(GATE) R30.2 R36.2
NetLED_60V_2: LED_60V.2(A) R183.1
NetQ7_3: Q7.3(SOURCE) Q8.3(SOURCE) R31.1 R32.1 R40.1
NetQ9_3: Q9.3(SOURCE) Q10.3(SOURCE) R33.1 R34.1 R41.1
NetQ11_3: Q11.3(SOURCE) Q12.3(SOURCE) R35.1 R36.1 R42.1
NetR37_2: R37.2 RJ1.1
NetR38_2: R38.2 RJ2.1
NetR39_2: R39.2 RJ3.1
NetR40_3: R40.3 RJ1.2
NetR40_4: R40.4 RJ4.2
NetR41_3: R41.3 RJ2.2
NetR41_4: R41.4 RJ5.2
NetR42_3: R42.3 RJ3.2
NetR42_4: R42.4 RJ6.2
NetR43_2: R43.2 RJ4.1
NetR44_2: R44.2 RJ5.1
NetR45_2: R45.2 RJ6.1
NetR183_2: R183.2 R184.1

### Buses and harness runs
harness port CS = sheet U_Analog_Sense/CS
harness port G_Signal = sheet U_Gate_Driver/G_Signal

### Layout directives
differential pair: V_Shunt_U_N, V_Shunt_U_P, V_Shunt_V_N, V_Shunt_V_P, V_Shunt_W_N, V_Shunt_W_P
net class HV; rule Clearance Constraint [Generic clearance = 30mil, and 31 value(s) for objects]: NetQ7_3, NetQ9_3, NetQ11_3, PH_U, PH_V, PH_W

### Notes on the sheet
- (in symbol Title_Block) Organization:; Team Garuda; Drawing By:; DWG No:; Checked By:; Size:; Institute:; RV College Of Engineering; Rev:; Web:; Date:; Sheet:; Of

### Library data of the parts
*?#3 = Title_Block: Standard Title Block
C1-C3 = GQM2195C2A181GB12D: CAP CER 180PF 100V NP0 0805; Manufacturer: Murata Electronics North America; Factory Stock: 0; Unit Price (USD): 1.44; Minimum Quantity: 1; Tolerance: ±2%; Temperature Coefficient: C0G, NP0; Datasheets: http://www.murata.com/~/media/webrenewal/support/library/catalog/products/capacitor/mlcc/c02e.pdf; Image: //media.digikey.com/Renders/Murata%20Renders/0805(GxM9).jpg; Digi-Key Part Number: 490-7180-1-ND; Part Number: GQM2195C2A181GB12D; Quantity Available: 7523; @ qty: 0; Packaging: Cut Tape (CT); Series: GQM; Part Status: Active; Value: 180pF; Voltage: 100V; Operating Temperature: -55°C ~ 125°C; Features: High Q, Low Loss; Ratings: -; Applications: RF, Microwave, High Frequency; Mounting Type: Surface Mount, MLCC; Package / Case: 0805 (2012 Metric); Size / Dimension: 0.079" L x 0.049" W (2.01mm x 1.25mm); Height - Seated (Max): -; Thickness (Max): 0.037" (0.95mm); Lead Spacing: -; Lead Style: -
C4-C6 = 890263425004CS: WCAP-FTBE THT Film Capacitors, 2.2uF, 100VDC; Insulation Resistance: 3000Ohm x F; Dissipation Factor@100kHz: 5%; Dissipation Factor@1kHz: 1%; Dissipation Factor@10kHz: 1.6%; Pitch: 15mm; Rate of Voltage Rise: 9V/us; Technical Reference: MPSP015225K100DCPP45004; ComponentLink1Description: Manufacturer; ComponentLink1URL: http://www.we-online.de; ComponentLink2Description: Datasheet; ComponentLink2URL: https://katalog.we-online.com/pbs/datasheet/890263425004CS.pdf; Length: 18mm; Mounting Technology: THT; Packaging: Carton; Part Number: 890263425004CS; Operating Temperature: -40 to +85degC; Width: 8.5mm; Capacitance: 2.2uF; Height: 15mm; Rated Voltage: 100VDC; Publisher: Wurth Elektronik; Published Date: August 2019
C7-C12 = 860040880007: WCAP-ATUL THT Aluminum Electrolytic Capacitors, D16mm x L25mm, 270uF, +/-20%, 100VDC; Dissipation Factor: 9%; Endurance: 10000h; Leakage Current: 270uA; Ripple Current max.: 1480mA; Technical Reference: ATDK250271M100DSPAEK000; ComponentLink1Description: Manufacturer; ComponentLink1URL: http://www.we-online.de; ComponentLink2Description: Datasheet; ComponentLink2URL: https://katalog.we-online.com/pbs/datasheet/860040880007.pdf; Length: 25mm; Mounting Technology: THT; Operating Temperature: -40 to +105degC; Packaging: Ammo Pack; Published Date: August 2019; Capacitance: 270uF; Diameter: 16mm; Part Number: 860040880007; Publisher: Wurth Elektronik; Capacitance Tolerance: +/-20%; Rated Voltage: 100VDC
C13 = GCD21BR71H104KA01L: as C39 on sheet Isolated_Bias; Datasheets: http://www.murata.com/~/media/webrenewal/support/library/catalog/products/capacitor/mlcc/c03e.ashx; Image: //media.digikey.com/Renders/Murata%20Renders/0805%28GxM6%29.jpg; Digi-Key Part Number: 490-11955-1-ND; Part Number: GCD21BR71H104KA01L; Quantity Available: 157; @ qty: 0; Packaging: Cut Tape (CT); Series: GCD; Part Status: Active; Value: 0.10µF; Voltage: 50V; Temperature Coefficient: X7R; Operating Temperature: -55°C ~ 125°C; Features: -; Ratings: AEC-Q200; Applications: Automotive; Mounting Type: Surface Mount, MLCC; Package / Case: 0805 (2012 Metric); Size / Dimension: 0.079" L x 0.049" W (2.00mm x 1.25mm); Height - Seated (Max): -; Thickness (Max): 0.049" (1.25mm); Lead Spacing: -; Lead Style: -
D1-D13 = CMP-12187-000026-1: DIODE SCHOTTKY 40V 300MA SOD523; Manufacturer: STMicroelectronics; Capacitance: 7pF; Value: 7pF; Max Surge Forward Current: 1.25A; Peak Reverse Current: 1uA; Max Junction Temp: +150°C; Device Class L2: Diodes; Temperature Range Low: -40°C; Category: Diode; Manufacturer Part Number: BAT54KFILM; Digikey Description: DIODE SCHOTTKY 40V 300MA SOD523; Device Class L3: Schottky Diodes; Automotive: No; Height: 0.7mm; Octopart: https://octopart.com/bat54kfilm-stmicroelectronics-39618022; ComponentLink2Description: Datasheet; Temperature Range High: +150°C; Device Class L1: Discrete Semiconductors; Max Repetitive Reverse Voltage: 40V; RoHS: TRUE; Temperature: -40°C to +150°C; ComponentLink2URL: https://www.st.com/content/ccc/resource/technical/document/datasheet/07/50/54/f2/0d/ba/4a/79/CD00001322.pdf/files/CD00001322.pdf/jcr:content/translations/en.CD00001322.pdf; Lead Free: Yes; Forward Current: 300mA; Package: SOD-523; Mouser Description: Schottky Diodes & Rectifiers schottky diode
LED_60V = 150080SS75000: as LED_5V on sheet Isolated_Bias; PackageReference: 0805_A; Color: Super Red; PartNumber: 150080SS75000; ComponentLink1Description: Manufacturer URL; ComponentLink1URL: http://www.we-online.com; ComponentLink2Description: Datasheet; ComponentLink2URL: http://katalog.we-online.com/led/datasheet/150080SS75000.pdf
Q1-Q12 = CUSTOM-MOS: 100V 120A; PartNumber: IPW65R110CFDA; Manufacturer: Infineon; QG: 118Â nC; Green: TRUE; Ptot (max): 277.8Â W; VGS(th) (max): 4.5Â V; VDS (max): 650Â V; RthJA (max): 62Â K/W; IDpuls (max): 99.6Â A; RDS (on) (max): 110Â mOhm; VGS(th) (min): 3.5Â V; Rth: 0.45Â K/W; Packing: Tube; ID (max): 31.2Â A; Polarity: N; ComponentLink1Description: Manufacturer URL; ComponentLink3Description: Package Specification; DatasheetVersion: Rev. 2.0; PackageDescription: 3-Pin Plastic (Green) Transistor Single Outline Package, 15.94 x 20.95 mm Body, 5.44 mm Pitch; Halogen-free: available; Mounting Technology: Through Hole; PackageVersion: Rev. 03; ComponentLink2Description: Datasheet; ComponentLink3URL: http://www.infineon.com/cms/packages/Leaded_and_through-hole/P-PG-TO247/P-PG-TO247-3-44.html?__locale=en; ComponentLink2URL: http://www.infineon.com/dgdl/DS_IPX65R110CFDA_2_0.pdf?folderId=db3a3043163797a6011637d4bae7003b&fileId=db3a304336797ff90136ba7c820925a5; Technology: CoolMOS CFDA; PackageReference: PG-TO247-3-44; ComponentLink1URL: http://www.infineon.com/; RthJC (max): 0.45Â K/W
R1-R12 R19-R30 = ERJ-P06J180V: RES SMD 18 OHM 5% 1/2W 0805; Manufacturer: Panasonic Electronic Components; Factory Stock: 0; Unit Price (USD): 0.01839; @ qty: 1500; Minimum Quantity: 1; Power (Watts): 0.5W, 1/2W; Temperature Coefficient: ±300ppm/°C; Part Number: ERJ-P06J180V; Datasheets: https://industrial.panasonic.com/cdbs/www-data/pdf/RDA0000/AOA0000C243.pdf; Image: //media.digikey.com/Renders/Panasonic%20Renders/ERJ-0805%20Pkg.jpg; Digi-Key Part Number: P18ADCT-ND; Quantity Available: 114565; Packaging: Cut Tape (CT); Series: ERJ; Part Status: Active; Value: 18; Tolerance: ±5%; Composition: Thick Film; Features: Automotive AEC-Q200, Pulse Withstanding; Operating Temperature: -55°C ~ 155°C; Package / Case: 0805 (2012 Metric); Supplier Device Package: 0805; Size / Dimension: 0.079" L x 0.049" W (2.00mm x 1.25mm); Height - Seated (Max): 0.028" (0.70mm); Number of Terminations: 2; Failure Rate: -
R13-R18 R31-R36 = ERJ-6ENF1002V: RES SMD 10K OHM 1% 1/8W 0805; Manufacturer: Panasonic Electronic Components; Factory Stock: 0; Unit Price (USD): 0.00729; @ qty: 1500; Minimum Quantity: 1; Power (Watts): 0.125W, 1/8W; Temperature Coefficient: ±100ppm/°C; Part Number: ERJ-6ENF1002V; Datasheets: http://industrial.panasonic.com/www-cgi/jvcr13pz.cgi?E+PZ+3+AOA0002+ERJ6ENF1002V+7+WW; Image: //media.digikey.com/Renders/Panasonic%20Renders/ERJ-0805%20Pkg.jpg; Digi-Key Part Number: P10.0KCCT-ND; Quantity Available: 3985614; Packaging: Cut Tape (CT); Series: ERJ; Part Status: Active; Value: 10k; Tolerance: ±1%; Composition: Thick Film; Features: Automotive AEC-Q200; Operating Temperature: -55°C ~ 155°C; Package / Case: 0805 (2012 Metric); Supplier Device Package: 0805; Size / Dimension: 0.079" L x 0.049" W (2.00mm x 1.25mm); Height - Seated (Max): 0.028" (0.70mm); Number of Terminations: 2; Failure Rate: -
R37-R39 R43-R45 = ERJ-6BQF1R5V: RES SMD 1.5 OHM 1% 1/3W 0805; Manufacturer: Panasonic Electronic Components; Factory Stock: 0; Unit Price (USD): 0.07013; @ qty: 1500; Minimum Quantity: 1; Power (Watts): 0.333W, 1/3W; Temperature Coefficient: ±200ppm/°C; Part Number: ERJ-6BQF1R5V; Datasheets: https://industrial.panasonic.com/cdbs/www-data/pdf/RDA0000/AOA0000C239.pdf; Image: //media.digikey.com/Renders/Panasonic%20Renders/ERJ-0805%20Pkg.jpg; Digi-Key Part Number: P15992CT-ND; Quantity Available: 5905; Packaging: Cut Tape (CT); Series: ERJ; Part Status: Active; Value: 1.5; Tolerance: ±1%; Composition: Thick Film; Features: Automotive AEC-Q200, Current Sense; Operating Temperature: -55°C ~ 125°C; Package / Case: 0805 (2012 Metric); Supplier Device Package: 0805; Size / Dimension: 0.079" L x 0.049" W (2.00mm x 1.25mm); Height - Seated (Max): 0.028" (0.70mm); Number of Terminations: 2; Failure Rate: -
R40-R42 = ERJ-M1WTF1M0U: RES SMD 0.001 OHM 1% 1W 2512; Manufacturer: Panasonic Electronic Components; Factory Stock: 0; Unit Price (USD): 0.26384; @ qty: 1500; Minimum Quantity: 1; Temperature Coefficient: 250/ +450ppm/°C; Part Number: ERJ-M1WTF1M0U; Datasheets: http://industrial.panasonic.com/www-cgi/jvcr13pz.cgi?E+PZ+3+AOA0007+ERJM1WTF1M0U+7+WW; Image: //media.digikey.com/Renders/Panasonic%20Renders/ERJ-2512%20Pkg.jpg; Digi-Key Part Number: P1.0NDCT-ND; Quantity Available: 22959; Packaging: Cut Tape (CT); Series: ERJ; Part Status: Active; Value: 0.001; Tolerance: ±1%; Power (Watts): 1W; Composition: Metal Element; Features: Current Sense; Operating Temperature: -55°C ~ 170°C; Package / Case: 2512 (6432 Metric); Supplier Device Package: 2512; Size / Dimension: 0.252" L x 0.126" W (6.40mm x 3.20mm); Height - Seated (Max): 0.043" (1.10mm); Number of Terminations: 2; Failure Rate: -
R46 = ERJ-6ENF1693V: RES SMD 169K OHM 1% 1/8W 0805; Manufacturer: Panasonic Electronic Components; Factory Stock: 0; Unit Price (USD): 0.00729; @ qty: 1500; Minimum Quantity: 1; Power (Watts): 0.125W, 1/8W; Temperature Coefficient: ±100ppm/°C; Part Number: ERJ-6ENF1693V; Datasheets: http://industrial.panasonic.com/www-cgi/jvcr13pz.cgi?E+PZ+3+AOA0002+ERJ6ENF1693V+7+WW; Image: //media.digikey.com/Renders/Panasonic%20Renders/ERJ-0805%20Pkg.jpg; Digi-Key Part Number: P169KCCT-ND; Quantity Available: 4864; Packaging: Cut Tape (CT); Series: ERJ; Part Status: Active; Value: 169k; Tolerance: ±1%; Composition: Thick Film; Features: Automotive AEC-Q200; Operating Temperature: -55°C ~ 155°C; Package / Case: 0805 (2012 Metric); Supplier Device Package: 0805; Size / Dimension: 0.079" L x 0.049" W (2.00mm x 1.25mm); Height - Seated (Max): 0.028" (0.70mm); Number of Terminations: 2; Failure Rate: -
R47 = ERJ-6ENF9311V: RES SMD 9.31K OHM 1% 1/8W 0805; Manufacturer: Panasonic Electronic Components; Factory Stock: 0; Unit Price (USD): 0.00729; @ qty: 1500; Minimum Quantity: 1; Power (Watts): 0.125W, 1/8W; Temperature Coefficient: ±100ppm/°C; Part Number: ERJ-6ENF9311V; Datasheets: http://industrial.panasonic.com/www-cgi/jvcr13pz.cgi?E+PZ+3+AOA0002+ERJ6ENF9311V+7+WW; Image: //media.digikey.com/Renders/Panasonic%20Renders/ERJ-0805%20Pkg.jpg; Digi-Key Part Number: P9.31KCCT-ND; Quantity Available: 47337; Packaging: Cut Tape (CT); Series: ERJ; Part Status: Active; Value: 9.31k; Tolerance: ±1%; Composition: Thick Film; Features: Automotive AEC-Q200; Operating Temperature: -55°C ~ 155°C; Package / Case: 0805 (2012 Metric); Supplier Device Package: 0805; Size / Dimension: 0.079" L x 0.049" W (2.00mm x 1.25mm); Height - Seated (Max): 0.028" (0.70mm); Number of Terminations: 2; Failure Rate: -
R183 R184 = ERJ-8ENF4701V: RES SMD 4.7K OHM 1% 1/4W 1206; Manufacturer: Panasonic Electronic Components; Factory Stock: 0; Unit Price (USD): 0.00933; @ qty: 1500; Minimum Quantity: 1; Power (Watts): 0.25W, 1/4W; Temperature Coefficient: ±100ppm/°C; Part Number: ERJ-8ENF4701V; Datasheets: http://industrial.panasonic.com/www-cgi/jvcr13pz.cgi?E+PZ+3+AOA0002+ERJ8ENF4701V+7+WW; Image: //media.digikey.com/Renders/Panasonic%20Renders/ERJ-1206%20Pkg.jpg; Digi-Key Part Number: P4.70KFCT-ND; Quantity Available: 213244; Packaging: Cut Tape (CT); Series: ERJ; Part Status: Active; Value: 4.7k; Tolerance: ±1%; Composition: Thick Film; Features: Automotive AEC-Q200; Operating Temperature: -55°C ~ 155°C; Package / Case: 1206 (3216 Metric); Supplier Device Package: 1206; Size / Dimension: 0.126" L x 0.063" W (3.20mm x 1.60mm); Height - Seated (Max): 0.028" (0.70mm); Number of Terminations: 2; Failure Rate: -
RJ1-RJ6 = CMP-009-00121-1: Max Operating Temperature: 155°C; Min Operating Temperature: -55°C; Pins: 2
T2-T4 = Phase_Connect